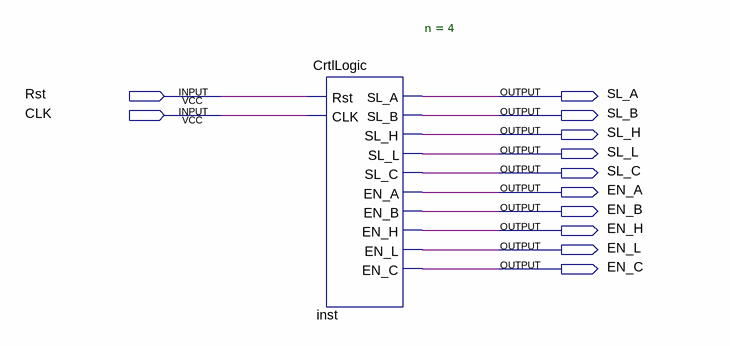
[diagram p0: schematic sheet]
// Quartus schematic CrtlLogic-schematic.bdf as structural Verilog: 1 symbols, 12 pins
module \CrtlLogic-schematic  (
  input  Rst,
  input  CLK,
  output SL_A,
  output SL_B,
  output SL_H,
  output SL_L,
  output SL_C,
  output EN_A,
  output EN_B,
  output EN_H,
  output EN_L,
  output EN_C
);

  CrtlLogic #(.n(4)) inst (
    .Rst(Rst), .CLK(CLK), .SL_A(SL_A), .SL_B(SL_B), .SL_H(SL_H), .SL_L(SL_L), .SL_C(SL_C), .EN_A(EN_A),
    .EN_B(EN_B), .EN_H(EN_H), .EN_L(EN_L), .EN_C(EN_C));
endmodule
